# Altium schematic sheet Schematic.SchDoc
size A3; SheetNumber: 1; SheetTotal: 1
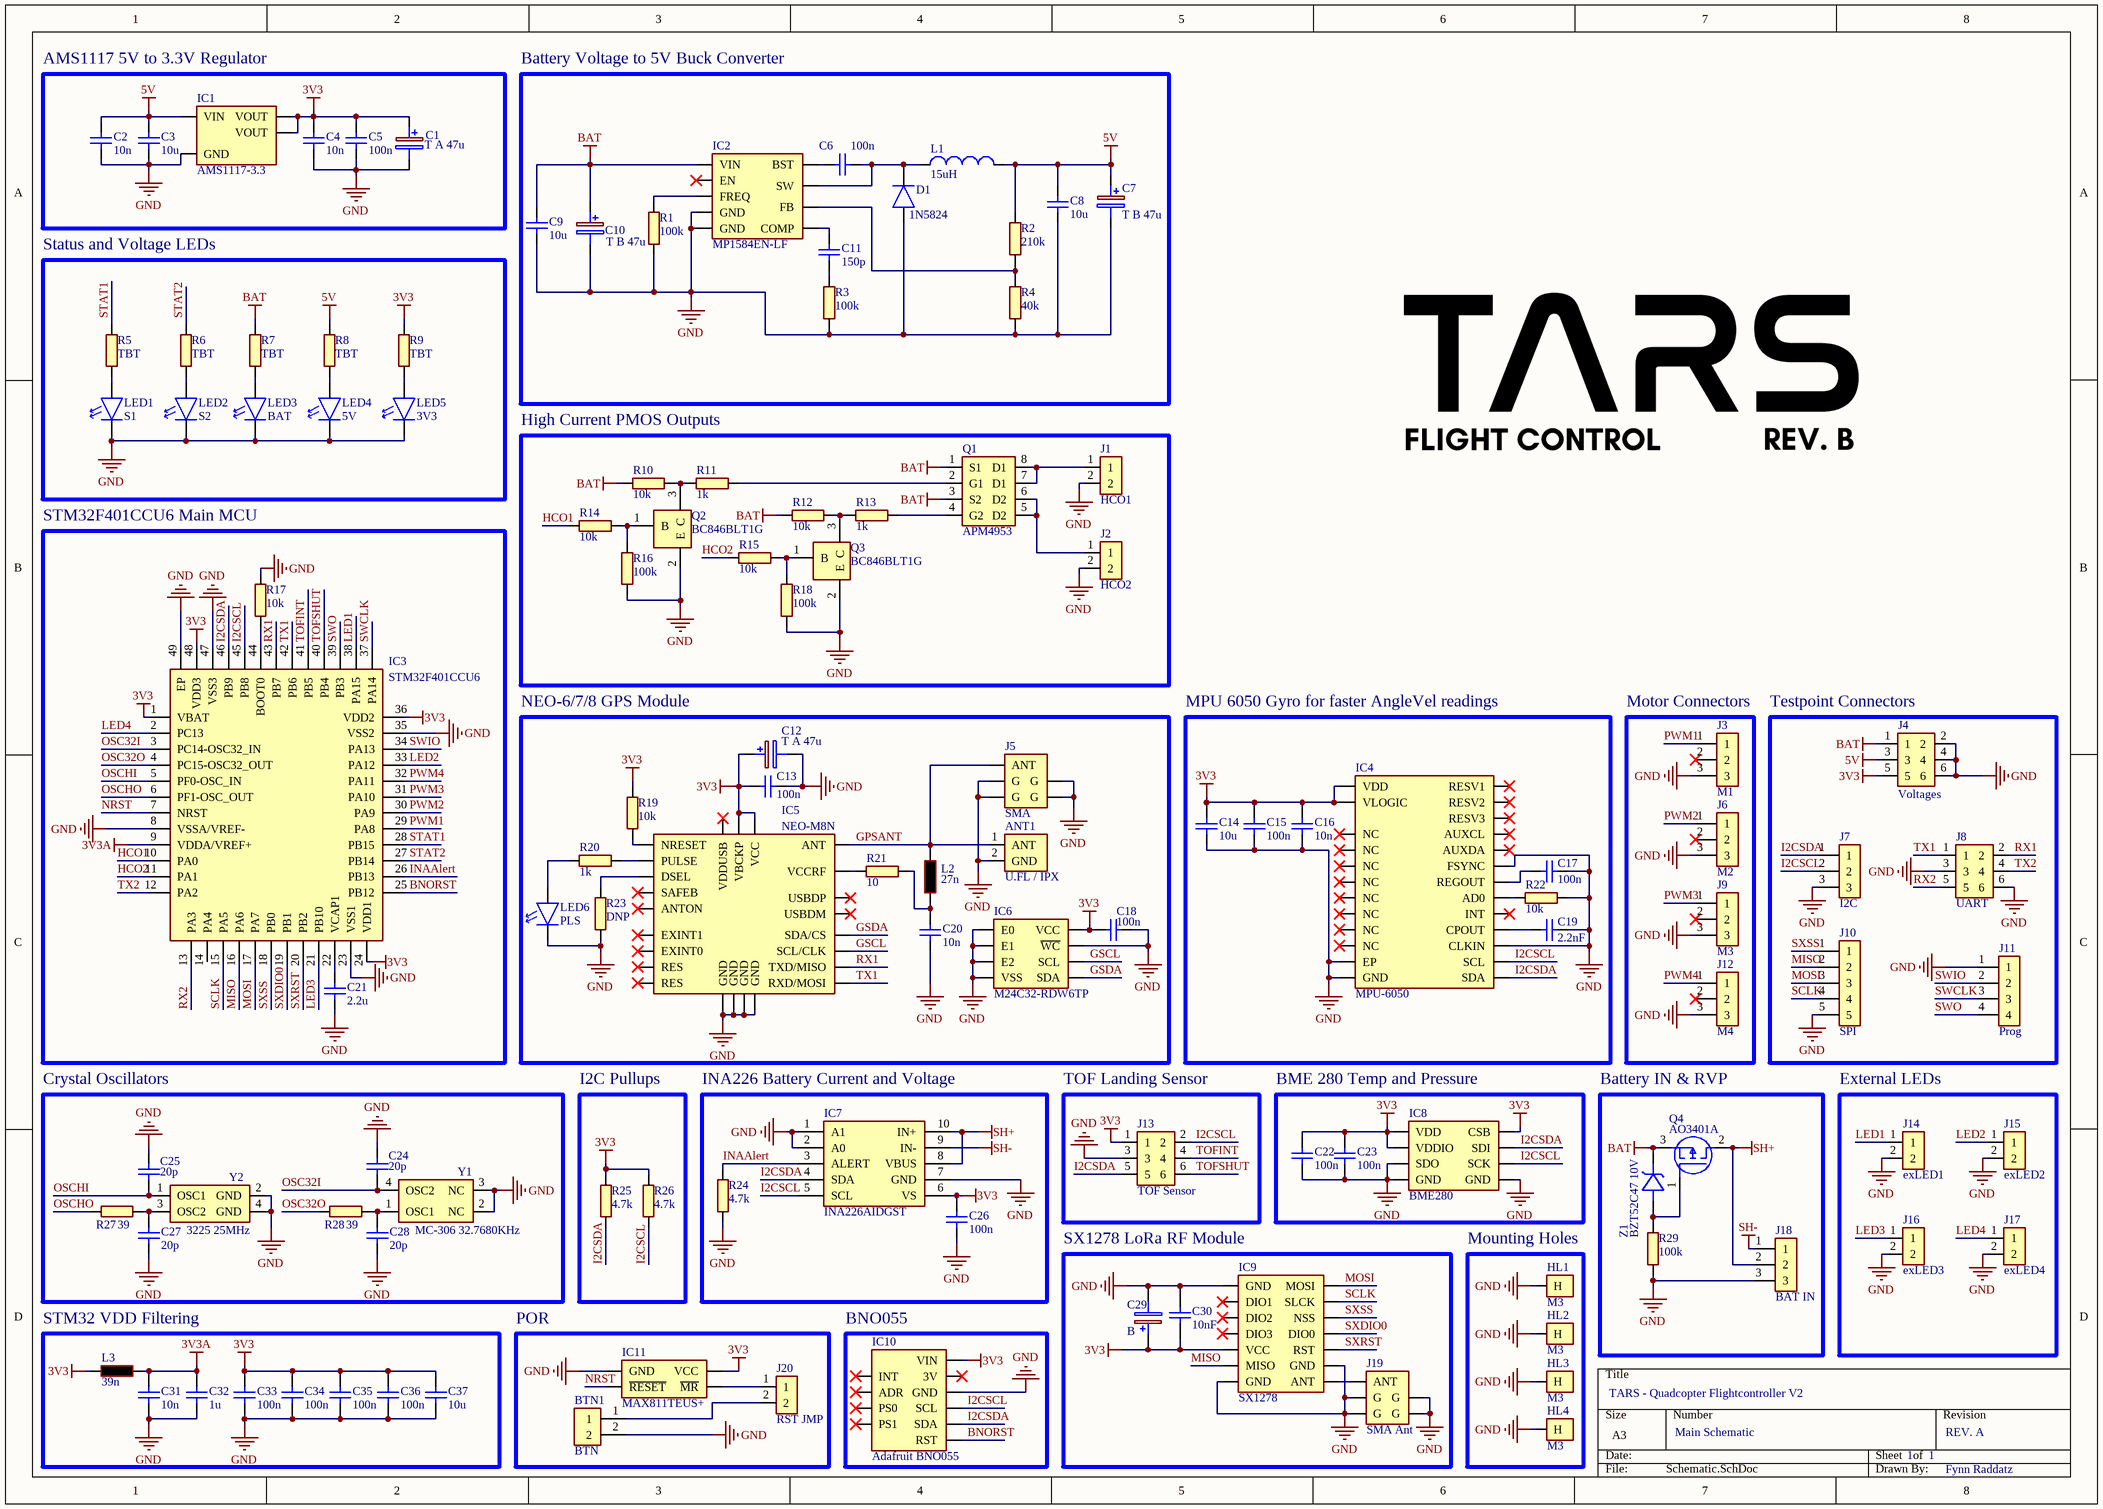
[diagram p0: Schematic.SchDoc]

## Parts
ANT1  U.FL / IPX  [U.FL IPX Connector]
BTN1  BTN  [SMD-Button-3*6mm]
C1  T A 47u  [Tantal-A-1206]
C2  10n  [CAPC2012 METRIC]
C3  10u  [CAPC2012 METRIC]
C4  10n  [CAPC2012 METRIC]
C5  100n  [CAPC2012 METRIC]
C6  100n  [CAPC2012 METRIC]
C7  T B 47u  [Tantal-B-1210]
C8  10u  [CAPC2012 METRIC]
C9  10u  [CAPC2012 METRIC]
C10  T B 47u  [Tantal-B-1210]
C11  150p  [CAPC2012 METRIC]
C12  T A 47u  [Tantal-A-1206]
C13  100n  [CAPC2012 METRIC]
C14  10u  [CAPC2012 METRIC]
C15  100n  [CAPC2012 METRIC]
C16  10n  [CAPC2012 METRIC]
C17  100n  [CAPC2012 METRIC]
C18  100n  [CAPC2012 METRIC]
C19  2.2nF  [CAPC2012 METRIC]
C20  10n  [CAPC2012 METRIC]
C21  2.2u  [CAPC2012 METRIC]
C22  100n  [CAPC2012 METRIC]
C23  100n  [CAPC2012 METRIC]
C24  20p  [CAPC2012 METRIC]
C25  20p  [CAPC2012 METRIC]
C26  100n  [CAPC2012 METRIC]
C27  20p  [CAPC2012 METRIC]
C28  20p  [CAPC2012 METRIC]
C29  B  [Tantal-B-1210]
C30  10nF  [CAPC2012 METRIC]
C31  10n  [CAPC2012 METRIC]
C32  1u  [CAPC2012 METRIC]
C33  100n  [CAPC2012 METRIC]
C34  100n  [CAPC2012 METRIC]
C35  100n  [CAPC2012 METRIC]
C36  100n  [CAPC2012 METRIC]
C37  10u  [CAPC2012 METRIC]
D1  1N5824  [DIOM5226X240N]
HL1  M3  [DRILL HOLE M3]
HL2  M3  [DRILL HOLE M3]
HL3  M3  [DRILL HOLE M3]
HL4  M3  [DRILL HOLE M3]
IC1  AMS1117-3.3  [SOT229P700X180-4N]
IC2  MP1584EN-LF  [SOIC127P600X170-9N]
IC3  STM32F401CCU6  [QFN50P700X700X60-49N-D]
IC4  MPU-6050  [MPU6050]
IC5  NEO-M8N  [NEO-M8T]
IC6  M24C32-RDW6TP  [SOP65P640X120-8N]
IC7  INA226AIDGST  [SOP50P490X110-10N]
IC8  BME280  [MODBME280]
IC9  SX1278  [SX1278]
IC10  Adafruit BNO055  [Adfruit BNO055]
IC11  MAX811TEUS+  [MAX811REUST]
J1  HCO1  [HDRV2W110P0X254_1X2_508X254X854P]
J2  HCO2  [HDRV2W110P0X254_1X2_508X254X854P]
J3  M1  [HDRV3W64P0X254_1X3_762X254X869P]
J4  Voltages  [HDRV6W64P0X254_1X6_1524X254X869P]
J5  SMA  [PCBRPSMAFRAHT]
J6  M2  [HDRV3W64P0X254_1X3_762X254X869P]
J7  I2C  [HDRV3W64P0X254_1X3_762X254X869P]
J8  UART  [HDRV6W64P0X254_1X6_1524X254X869P]
J9  M3  [HDRV3W64P0X254_1X3_762X254X869P]
J10  SPI  [HDRV5W64P0X254_1X5_1270X254X854P]
J11  Prog  [HDRV4W95P0X254_1X4_1016X254X854P]
J12  M4  [HDRV3W64P0X254_1X3_762X254X869P]
J13  TOF Sensor  [HDRV6W64P0X254_1X6_1524X254X869P]
J14  exLED1  [HDRV2W110P0X254_1X2_508X254X854P]
J15  exLED2  [HDRV2W110P0X254_1X2_508X254X854P]
J16  exLED3  [HDRV2W110P0X254_1X2_508X254X854P]
J17  exLED4  [HDRV2W110P0X254_1X2_508X254X854P]
J18  BAT IN  [HDRV3W64P0X254_1X3_762X254X869P]
J19  SMA Ant  [PCBRPSMAFRAHT]
J20  RST JMP  [HDRV2W110P0X254_1X2_508X254X854P]
L1  15uH  [0630 Inductor]
L2  27n  [RESC2012X65N]
L3  39n  [RESC2012X65N]
LED1  S1  [0805 LED]
LED2  S2  [0805 LED]
LED3  BAT  [0805 LED]
LED4  5V  [0805 LED]
LED5  3V3  [0805 LED]
LED6  PLS  [0805 LED]
Q1  APM4953  [SOIC127P600X175-8N]
Q2  BC846BLT1G  [SOT96P237X111-3N]
Q3  BC846BLT1G  [SOT96P237X111-3N]
Q4  AO3401A  [SOT95P280X125-3N]
R1  100k  [RESC2012X65N]
R2  210k  [RESC2012X65N]
R3  100k  [RESC2012X65N]
R4  40k  [RESC2012X65N]
R5  TBT  [RESC2012X65N]
R6  TBT  [RESC2012X65N]
R7  TBT  [RESC2012X65N]
R8  TBT  [RESC2012X65N]
R9  TBT  [RESC2012X65N]
R10  10k  [RESC2012X65N]
R11  1k  [RESC2012X65N]
R12  10k  [RESC2012X65N]
R13  1k  [RESC2012X65N]
R14  10k  [RESC2012X65N]
R15  10k  [RESC2012X65N]
R16  100k  [RESC2012X65N]
R17  10k  [RESC2012X65N]
R18  100k  [RESC2012X65N]
R19  10k  [RESC2012X65N]
R20  1k  [RESC2012X65N]
R21  10  [RESC2012X65N]
R22  10k  [RESC2012X65N]
R23  DNP  [RESC2012X65N]
R24  4.7k  [RESC2012X65N]
R25  4.7k  [RESC2012X65N]
R26  4.7k  [RESC2012X65N]
R27  39  [RESC2012X65N]
R28  39  [RESC2012X65N]
R29  100k  [RESC2012X65N]
Y1  MC-306 32.7680KHz  [MC306327680KA3ROHS]
Y2  3225 25MHz  [TSX3225240000MF20GAC0]
Z1  BZT52C47 10V  [BZT52C47]

## Blocks framed on the sheet
AMS1117 5V to 3.3V Regulator: C1-C5 IC1
Battery Voltage to 5V Buck Converter: C6-C11 D1 IC2 L1 R1-R4
Status and Voltage LEDs: LED1-LED5 R5-R9
High Current PMOS Outputs: J1 J2 Q1-Q3 R10-R16 R18
STM32F401CCU6 Main MCU: C21 IC3 R17
NEO-6/7/8 GPS Module: ANT1 C12 C13 C18 C20 IC5 IC6 J5 L2 LED6 R19-R21 R23
MPU 6050 Gyro for faster AngleVel readings: C14-C17 C19 IC4 R22
Motor Connectors: J3 J6 J9 J12
Testpoint Connectors: J4 J7 J8 J10 J11
Crystal Oscillators: C24 C25 C27 C28 R27 R28 Y1 Y2
I2C Pullups: R25 R26
INA226 Battery Current and Voltage: C26 IC7 R24
TOF Landing Sensor: J13
BME 280 Temp and Pressure: C22 C23 IC8
Battery IN & RVP: J18 Q4 R29 Z1
External LEDs: J14-J17
SX1278 LoRa RF Module: C29 C30 IC9 J19
Mounting Holes: HL1-HL4
STM32 VDD Filtering: C31-C37 L3
POR: BTN1 IC11 J20
BNO055: IC10

## Nets
3V3: C1.1(+) C4.1 C5.1 C12.1(+) C13.2 C14.1 C15.1 C16.1 C18.2 C22.1 C23.1 C26.2 C29.1(+) C30.2 C33.2 C34.2 C35.2 C36.2 C37.2 IC1.2(VOUT) IC1.4(VOUT) IC3.1(VBAT) IC3.24(VDD1) IC3.36(VDD2) IC3.48(VDD3) IC4.8(VLOGIC) IC4.13(VDD) IC5.22(VBCKP) IC5.23(VCC) IC6.8(VCC) IC7.6(VS) IC8.2(CSB) IC8.6(VDDIO) IC8.8(VDD) IC9.5(VCC) IC10.5(VIN) IC11.4(VCC) J4.5 J13.1 L3.2 R9.1 R19.2 R25.2 R26.2
3V3A: C31.2 C32.2 IC3.9(VDDA/VREF+) L3.1
5V: C2.1 C3.1 C7.1(+) C8.1 IC1.3(VIN) J4.3 L1.2 R2.1 R8.1
BAT: C9.1 C10.1(+) IC2.7(VIN) J4.1 Q1.1(S1) Q1.3(S2) Q4.3(S) R7.1 R10.1 R12.1 Z1.1(K)
GND: ANT1.2(GND) BTN1.2 C1.2(-) C2.2 C3.2 C4.2 C5.2 C7.2(-) C8.2 C9.2 C10.2(-) C12.2(-) C13.1 C14.2 C15.2 C16.2 C17.2 C18.1 C19.2 C20.2 C21.1 C22.2 C23.2 C24.2 C25.2 C26.1 C27.1 C28.1 C29.2(-) C30.1 C31.1 C32.1 C33.1 C34.1 C35.1 C36.1 C37.1 D1.2(A) HL1.1(H) HL2.1(H) HL3.1(H) HL4.1(H) IC1.1(GND) IC2.5(GND) IC2.9(GND) IC3.8(VSSA/VREF-) IC3.23(VSS1) IC3.35(VSS2) IC3.47(VSS3) IC3.49(EP) IC4.1(CLKIN) IC4.11(FSYNC) IC4.18(GND) IC4.25(EP) IC5.10(GND) IC5.12(GND) IC5.13(GND) IC5.24(GND) IC6.1(E0) IC6.2(E1) IC6.3(E2) IC6.4(VSS) IC6.7(~{WC}) IC7.1(A1) IC7.2(A0) IC7.7(GND) IC8.1(GND) IC8.5(SDO) IC8.7(GND) IC9.1(GND) IC9.12(GND) IC9.14(GND) IC10.7(GND) IC11.1(GND) J1.2 J2.2 J3.3 J4.2 J4.4 J4.6 J5.2(G) J5.3(G) J5.4(G) J5.5(G) J6.3 J7.3 J8.3 J8.6 J9.3 J10.5 J11.1 J12.3 J13.3 J14.2 J15.2 J16.2 J17.2 J18.3 J19.2(G) J19.3(G) J19.4(G) J19.5(G) LED1.2(K) LED2.2(K) LED3.2(K) LED4.2(K) LED5.2(K) LED6.2(K) Q2.2(E) Q3.2(E) R1.2 R3.2 R4.2 R16.2 R17.2 R18.2 R22.1 R23.2 R24.1 R29.2 Y1.2(NC) Y1.3(NC) Y2.2(GND) Y2.4(GND)
SH+: IC7.8(VBUS) IC7.10(IN+) J18.2 Q4.2(D)
SH-: IC7.9(IN-) J18.1
BNORST: IC3.25(PB12) IC10.10(RST)
GPSANT: ANT1.1(ANT) IC5.11(ANT) J5.1(ANT) L2.2
GSCL: IC5.19(SCL/CLK) IC6.6(SCL)
GSDA: IC5.18(SDA/CS) IC6.5(SDA)
HCO1: IC3.10(PA0) R14.1
HCO2: IC3.11(PA1) R15.1
I2CSCL: IC3.45(PB8) IC4.23(SCL) IC7.5(SCL) IC8.4(SCK) IC10.8(SCL) J7.2 J13.2 R26.1
I2CSDA: IC3.46(PB9) IC4.24(SDA) IC7.4(SDA) IC8.3(SDI) IC10.9(SDA) J7.1 J13.5 R25.1
INAAlert: IC3.26(PB13) IC7.3(ALERT) R24.2
LED1: IC3.38(PA15) J14.1
LED2: IC3.33(PA12) J15.1
LED3: IC3.21(PB10) J16.1
LED4: IC3.2(PC13) J17.1
MISO: IC3.16(PA6) IC9.6(MISO) J10.2
MOSI: IC3.17(PA7) IC9.7(MOSI) J10.3
NRST: IC3.7(NRST) IC11.2(~{RESET})
OSC32I: C24.1 IC3.3(PC14-OSC32_IN) Y1.4(OSC2)
OSC32O: IC3.4(PC15-OSC32_OUT) R28.2
OSCHI: C25.1 IC3.5(PF0-OSC_IN) Y2.1(OSC1)
OSCHO: IC3.6(PF1-OSC_OUT) R27.2
PWM1: IC3.29(PA8) J3.1
PWM2: IC3.30(PA9) J6.1
PWM3: IC3.31(PA10) J9.1
PWM4: IC3.32(PA11) J12.1
RX1: IC3.43(PB7) IC5.20(TXD/MISO) J8.2
RX2: IC3.13(PA3) J8.5
SCLK: IC3.15(PA5) IC9.8(SLCK) J10.4
STAT1: IC3.28(PB15) R5.1
STAT2: IC3.27(PB14) R6.1
SWCLK: IC3.37(PA14) J11.3
SWIO: IC3.34(PA13) J11.2
SWO: IC3.39(PB3) J11.4
SXDIO0: IC3.19(PB1) IC9.10(DIO0)
SXRST: IC3.20(PB2) IC9.11(RST)
SXSS: IC3.18(PB0) IC9.9(NSS) J10.1
TOFINT: IC3.41(PB5) J13.4
TOFSHUT: IC3.40(PB4) J13.6
TX1: IC3.42(PB6) IC5.21(RXD/MOSI) J8.1
TX2: IC3.12(PA2) J8.4
NetBTN1_1: BTN1.1 J20.2
NetC6_1: C6.1 IC2.8(BST)
NetC6_2: C6.2 D1.1(K) IC2.1(SW) L1.1
NetC11_1: C11.1 IC2.3(COMP)
NetC11_2: C11.2 R3.1
NetC17_1: C17.1 IC4.10(REGOUT)
NetC19_1: C19.1 IC4.20(CPOUT)
NetC20_1: C20.1 L2.1 R21.1
NetC21_2: C21.2 IC3.22(VCAP1)
NetC27_2: C27.2 R27.1 Y2.3(OSC2)
NetC28_2: C28.2 R28.1 Y1.1(OSC1)
NetIC2_4: IC2.4(FB) R2.2 R4.1
NetIC2_6: IC2.6(FREQ) R1.1
NetIC3_44: IC3.44(BOOT0) R17.1
NetIC4_9: IC4.9(AD0) R22.2
NetIC5_2: IC5.2(DSEL) R23.1
NetIC5_3: IC5.3(PULSE) R20.1
NetIC5_8: IC5.8(NRESET) R19.1
NetIC5_9: IC5.9(VCCRF) R21.2
NetIC9_13: IC9.13(ANT) J19.1(ANT)
NetIC11_3: IC11.3(~{MR}) J20.1
NetJ1_1: J1.1 Q1.7(D1) Q1.8(D1)
NetJ2_1: J2.1 Q1.5(D2) Q1.6(D2)
NetLED1_1: LED1.1(A) R5.2
NetLED2_1: LED2.1(A) R6.2
NetLED3_1: LED3.1(A) R7.2
NetLED4_1: LED4.1(A) R8.2
NetLED5_1: LED5.1(A) R9.2
NetLED6_1: LED6.1(A) R20.2
NetQ1_2: Q1.2(G1) R11.2
NetQ1_4: Q1.4(G2) R13.2
NetQ2_1: Q2.1(B) R14.2 R16.1
NetQ2_3: Q2.3(C) R10.2 R11.1
NetQ3_1: Q3.1(B) R15.2 R18.1
NetQ3_3: Q3.3(C) R12.2 R13.1
NetQ4_1: Q4.1(G) R29.1 Z1.2(A)

Not connected (* = marked no-connect by the designer): IC2 2(EN)*; IC3 14(PA4); IC4 2(NC)* 3(NC)* 4(NC)* 5(NC)* 6(AUXDA)* 7(AUXCL)* 12(INT)* 14(NC)* 15(NC)* 16(NC)* 17(NC)* 19(RESV1)* 21(RESV2)* 22(RESV3)*; IC5 1(SAFEB)* 4(EXINT0)* 5(USBDM)* 6(USBDP)* 7(VDDUSB)* 14(ANTON)* 15(EXINT1)* 16(RES)* 17(RES)*; IC9 2(DIO1)* 3(DIO2)* 4(DIO3)*; IC10 1(INT)* 2(ADR)* 3(PS0)* 4(PS1)* 6(3V)*; J3 2*; J6 2*; J9 2*; J12 2*

## Notes on the sheet
- TARS - Quadcopter Flightcontroller V2
- Main Schematic
- REV. A
- Fynn Raddatz

## Library data of the parts
ANT1 = U.FL SMD Antenna Connector: Connector
BTN1 = SMDButton-3*6mm: Button
C1 C12 = TANTAL-A: Capacitor Tantalum
C2-C6 C8 C9 C11 C13-C28 C31-C37 = Cap 0805 IMP: Capacitor; Manufacturer_Name: Samsung Electro-Mechanics; Manufacturer_Part_Number: CL21B104KACNNNC; Datasheet Link: http://www.samsungsem.com/kr/support/product-search/mlcc/__icsFiles/afieldfile/2016/08/18/S_CL21B104KACNNNC.pdf; Height: 0.95mm; Mouser Part Number: N/A; Mouser Price/Stock: https://www.mouser.co.uk/ProductDetail/Samsung-Electro-Mechanics/CL21B104KACNNNC?qs=yOVawPpwOwnhB47kNbieFw%3D%3D; Arrow Part Number: CL21B104KACNNNC; Arrow Price/Stock: https://www.arrow.com/en/products/cl21b104kacnnnc/samsung-electro-mechanics
C7 C10 C29 = TANTAL-B: Capacitor Tantalum
C30 = CL21B104KACNNNC: Capacitor; Manufacturer_Name: Samsung Electro-Mechanics; Datasheet Link: http://www.samsungsem.com/kr/support/product-search/mlcc/__icsFiles/afieldfile/2016/08/18/S_CL21B104KACNNNC.pdf; Height: 0.95mm; Manufacturer_Part_Number: CL21B104KACNNNC; Mouser Part Number: N/A; Mouser Price/Stock: https://www.mouser.co.uk/ProductDetail/Samsung-Electro-Mechanics/CL21B104KACNNNC?qs=yOVawPpwOwnhB47kNbieFw%3D%3D; Arrow Part Number: CL21B104KACNNNC; Arrow Price/Stock: https://www.arrow.com/en/products/cl21b104kacnnnc/samsung-electro-mechanics
D1 = B160-13-F: Diode; Manufacturer_Name: Diodes Inc.; Datasheet Link: http://uk.rs-online.com/web/p/products/7384765; Height: 2.4mm; Manufacturer_Part_Number: B160-13-F; Mouser Part Number: 621-B160-F; Mouser Price/Stock: https://www.mouser.co.uk/ProductDetail/Diodes-Incorporated/B160-13-F/?qs=SQxTiZ%252BdFLDKHRPMwjkKCg%3D%3D; Arrow Part Number: B160-13-F; Arrow Price/Stock: https://www.arrow.com/en/products/b160-13-f/diodes-incorporated
HL1-HL4 = M3 Mouting Hole: Mounting Hole
IC1 = AMS1117-3.3: Integrated Circuit; Manufacturer_Name: Advanced Monolithic Systems; Datasheet Link: http://www.advanced-monolithic.com/pdf/ds1117.pdf; Height: 1.8mm; Manufacturer_Part_Number: AMS1117-3.3
IC2 = MP1584EN-LF: Integrated Circuit; Manufacturer_Name: Monolithic Power Systems (MPS); Datasheet Link: https://componentsearchengine.com/Datasheets/1/MP1584EN-LF.pdf; Height: 1.7mm; Manufacturer_Part_Number: MP1584EN-LF; Mouser Part Number: 946-MP1584ENLF; Mouser Price/Stock: https://www.mouser.com/Search/Refine.aspx?Keyword=946-MP1584ENLF
IC3 = STM32F401CCU6: Integrated Circuit; Manufacturer_Name: STMicroelectronics; Datasheet Link: http://www.st.com/web/en/resource/technical/document/datasheet/DM00086815.pdf; Height: 0.6mm; Manufacturer_Part_Number: STM32F401CCU6; Mouser Part Number: 511-STM32F401CCU6; Mouser Price/Stock: https://www.mouser.co.uk/ProductDetail/STMicroelectronics/STM32F401CCU6?qs=DqCdCwOw4%2F5VrOZQxO795A%3D%3D; Arrow Part Number: STM32F401CCU6; Arrow Price/Stock: https://www.arrow.com/en/products/stm32f401ccu6/stmicroelectronics?region=nac
IC4 = MPU-6050: Integrated Circuit; Manufacturer_Name: TDK; Datasheet Link: https://www.invensense.com/products/motion-tracking/6-axis/mpu-6050/; Height: 3mm; Manufacturer_Part_Number: MPU-6050; Mouser Part Number: 410-MPU-6050; Mouser Price/Stock: https://www.mouser.co.uk/ProductDetail/TDK-InvenSense/MPU-6050/?qs=u4fy%2FsgLU9O14B5JgyQFvg%3D%3D; Arrow Part Number: MPU-6050; Arrow Price/Stock: https://www.arrow.com/en/products/mpu-6050/invensense
IC5 = NEO-M8N: Integrated Circuit; Manufacturer_Name: U-Blox; Manufacturer_Part_Number: NEO-M8N-0-10; Datasheet Link: https://www.u-blox.com/sites/default/files/NEO-M8-FW3_DataSheet_%28UBX-15031086%29.pdf
IC6 = M24C32-RDW6TP: Integrated Circuit; Manufacturer_Name: STMicroelectronics; Datasheet Link: http://www.st.com/content/ccc/resource/technical/document/datasheet/80/4e/8c/54/f2/63/4c/4a/CD00001012.pdf/files/CD00001012.pdf/jcr:content/translations/en.CD00001012.pdf; Height: 1.2mm; Manufacturer_Part_Number: M24C32-RDW6TP; Mouser Part Number: 511-M24C32-RDW6TP; Mouser Price/Stock: https://www.mouser.co.uk/ProductDetail/STMicroelectronics/M24C32-RDW6TP/?qs=%252B9pWl1iD4MVhMVBjnj8NEA%3D%3D; Arrow Part Number: M24C32-RDW6TP; Arrow Price/Stock: https://www.arrow.com/en/products/m24c32-rdw6tp/stmicroelectronics
IC7 = INA226AIDGST: Integrated Circuit; Manufacturer_Name: Texas Instruments; Datasheet Link: http://www.ti.com/lit/gpn/ina226; Height: 1.1mm; Manufacturer_Part_Number: INA226AIDGST; Mouser Part Number: 595-INA226AIDGST; Mouser Price/Stock: https://www.mouser.co.uk/ProductDetail/Texas-Instruments/INA226AIDGST?qs=tQG3bEuiOZB3Ay2BJOjnEQ%3D%3D; Arrow Part Number: INA226AIDGST; Arrow Price/Stock: https://www.arrow.com/en/products/ina226aidgst/texas-instruments
IC8 = MOD-BME280: Integrated Circuit; Manufacturer_Name: Olimex Ltd.; Datasheet Link: https://eu.mouser.com/datasheet/2/306/BME280-1620794.pdf; Height: 1mm; Manufacturer_Part_Number: MOD-BME280; Mouser Part Number: 909-MOD-BME280; Mouser Price/Stock: https://www.mouser.co.uk/ProductDetail/Olimex-Ltd/MOD-BME280/?qs=%252B6g0mu59x7K82sEO3yPPgg%3D%3D
IC9 = SX1278: RF
IC11 = MAX811TEUS+: Integrated Circuit; Manufacturer_Name: Maxim Integrated; Datasheet Link: https://pdfserv.maximintegrated.com/en/ds/MAX811-MAX812.pdf; Manufacturer_Part_Number: MAX811TEUS+
J1 J2 J14-J17 J20 = 61300211121: Connector; Manufacturer_Name: Wurth Elektronik; Datasheet Link: https://componentsearchengine.com/Datasheets/2/61300211121.pdf; Height: 8.54mm; Manufacturer_Part_Number: 61300211121; Mouser Part Number: 710-61300211121; Mouser Price/Stock: https://www.mouser.co.uk/ProductDetail/Wurth-Elektronik/61300211121/?qs=t4813l51qx%252B1A5GYDQxPlw%3D%3D
J3 J6 J7 J9 J12 J18 = 61300311121: Connector; Manufacturer_Name: Wurth Elektronik; Datasheet Link: http://katalog.we-online.de/em/datasheet/6130xx11121.pdf; Height: 8.69mm; Manufacturer_Part_Number: 61300311121; Mouser Part Number: 710-61300311121; Mouser Price/Stock: https://www.mouser.co.uk/ProductDetail/Wurth-Elektronik/61300311121/?qs=PhR8RmCirEYxRWFJzNKsUw%3D%3D
J4 J8 J13 = 61300611121: Connector; Manufacturer_Name: Wurth Elektronik; Datasheet Link: https://componentsearchengine.com/Datasheets/2/61300611121.pdf; Height: 8.69mm; Manufacturer_Part_Number: 61300611121; Mouser Part Number: 710-61300611121; Mouser Price/Stock: https://www.mouser.co.uk/ProductDetail/Wurth-Elektronik/61300611121?qs=t4813l51qx%2FRpdf0Kp1HlQ%3D%3D
J5 J19 = SMA Antenna: Connector; Manufacturer_Name: Taoglas; Manufacturer_Part_Number: PCB.RPSMAFRA.HT; Datasheet Link: http://www.taoglas.com/wp-content/uploads/2016/01/PCB.RPSMAFRA.HT_.pdf; Height: 7.4mm; Mouser Part Number: 960-PCB.RPSMAFRA.HT; Mouser Price/Stock: https://www.mouser.co.uk/ProductDetail/Taoglas/PCBRPSMAFRAHT/?qs=RuW%2Fu%252BNMQmvVc2WiXpnkVw%3D%3D
J10 = 61300511121: Connector; Manufacturer_Name: Wurth Elektronik; Datasheet Link: http://katalog.we-online.de/em/datasheet/6130xx11121.pdf; Height: 8.54mm; Manufacturer_Part_Number: 61300511121; Mouser Part Number: 710-61300511121; Mouser Price/Stock: https://www.mouser.co.uk/ProductDetail/Wurth-Elektronik/61300511121/?qs=PhR8RmCirEZCsCRHq%252BvfRQ%3D%3D
J11 = 61300411121: Connector; Manufacturer_Name: Wurth Elektronik; Datasheet Link: http://katalog.we-online.de/em/datasheet/6130xx11121.pdf; Height: 8.54mm; Manufacturer_Part_Number: 61300411121; Mouser Part Number: 710-61300411121; Mouser Price/Stock: https://www.mouser.co.uk/ProductDetail/Wurth-Elektronik/61300411121?qs=PhR8RmCirEYQcLLqXD8rAA%3D%3D
L1 = 0630 Inductor: Inductor
L2 L3 = 0805 Inductor: Inductor
LED1-LED6 = LED 0805: LED
Q1 = APM4953: MOSFET (P-Channel); Manufacturer_Name: Guangdong Hottech; Datasheet Link: https://datasheet.lcsc.com/szlcsc/Guangdong-Hottech-4953_C181099.pdf; Height: 1.75mm; Manufacturer_Part_Number: APM4953
Q2 Q3 = BC846BLT1G: Integrated Circuit; Manufacturer_Name: ON Semiconductor; Datasheet Link: http://www.onsemi.com/pub/Collateral/BC846ALT1-D.PDF; Height: 1.11mm; Manufacturer_Part_Number: BC846BLT1G; Mouser Part Number: 863-BC846BLT1G; Mouser Price/Stock: https://www.mouser.co.uk/ProductDetail/onsemi/BC846BLT1G?qs=vNc2DXHODiJuwwGLruzsRg%3D%3D; Arrow Part Number: BC846BLT1G; Arrow Price/Stock: https://www.arrow.com/en/products/bc846blt1g/on-semiconductor
Q4 = AO3401A: MOSFET (P-Channel); Manufacturer_Name: Alpha & Omega Semiconductors; Datasheet Link: http://www.aosmd.com/pdfs/datasheet/AO3401A.pdf; Height: 1.25mm; Manufacturer_Part_Number: AO3401A; Arrow Part Number: AO3401A; Arrow Price/Stock: https://www.arrow.com/en/products/ao3401a/alpha-and-omega-semiconductor?region=nac
R1-R29 = Res 0805: Resistor; Manufacturer_Name: Stackpole Electronics Inc.; Manufacturer_Part_Number: RMCF0805ZT0R00; Datasheet Link: https://www.seielect.com/Catalog/SEI-RMCF_RMCP.pdf; Height: 0.65mm; Arrow Part Number: RMCF0805ZT0R00; Arrow Price/Stock: https://www.arrow.com/en/products/rmcf0805zt0r00/stackpole-electronics
Y1 = MC-306_32.7680K-A3_ROHS: Crystal or Oscillator; Manufacturer_Name: Epson Timing; Manufacturer_Part_Number: MC-306 32.7680K-A3:ROHS; Datasheet Link: https://componentsearchengine.com/Datasheets/1/MC-306 32.7680K-A3_ROHS.pdf; Height: 2.54mm; Mouser Part Number: 732-MC306-32.7KA3R; Mouser Price/Stock: https://www.mouser.co.uk/ProductDetail/Epson-Timing/MC-306-327680K-A3ROHS/?qs=CU9taR8hkvbxBMNmXnQ1pw%3D%3D
Y2 = 3225 Oscillator: Crystal or Oscillator; Manufacturer_Name: Epson Timing; Manufacturer_Part_Number: TSX-3225 16.0000MF10U-B0; Datasheet Link: https://support.epson.biz/td/api/doc_check.php?dl=brief_TSX-3225&lang=en; Height: 0.6mm; Mouser Part Number: 732-322516MF10U-B0; Mouser Price/Stock: https://www.mouser.co.uk/ProductDetail/Epson-Timing/TSX-3225-160000MF10U-B0?qs=%252B0hcjpVv37o282i6EmdVvw%3D%3D
Z1 = BZT52C47: Diode Zener; Manufacturer_Name: Taiwan Semiconductor; Datasheet Link: https://www.mouser.com/datasheet/2/395/BZT52C2V4_SERIES_G1804-1393215.pdf; Height: 1.15mm; Manufacturer_Part_Number: BZT52C47; Mouser Part Number: 821-BZT52C47; Mouser Price/Stock: https://www.mouser.co.uk/ProductDetail/Taiwan-Semiconductor/BZT52C47?qs=tHU%2FlV7kTyS%252BAcVYuoc%2Fdw%3D%3D